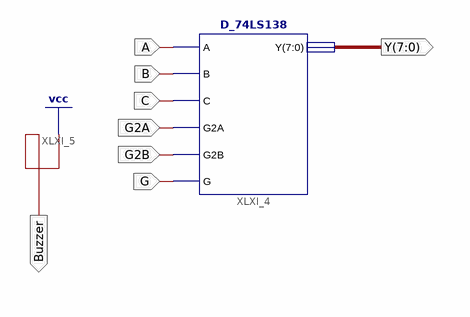
[diagram p0: schematic sheet 1]
// Xilinx ISE schematic D_74LS138_Test.sch (kintex7) as structural Verilog: 1 symbols, 8 ports
module D_74LS138_Test (
  input  A,
  input  B,
  input  C,
  input  G2A,
  input  G2B,
  input  G,
  output [7:0] Y,
  output Buzzer
);

  D_74LS138 XLXI_4 (.A(A), .B(B), .C(C), .G2A(G2A), .G2B(G2B), .G(G), .Y(Y));

  assign Buzzer = 1'b1;
endmodule
